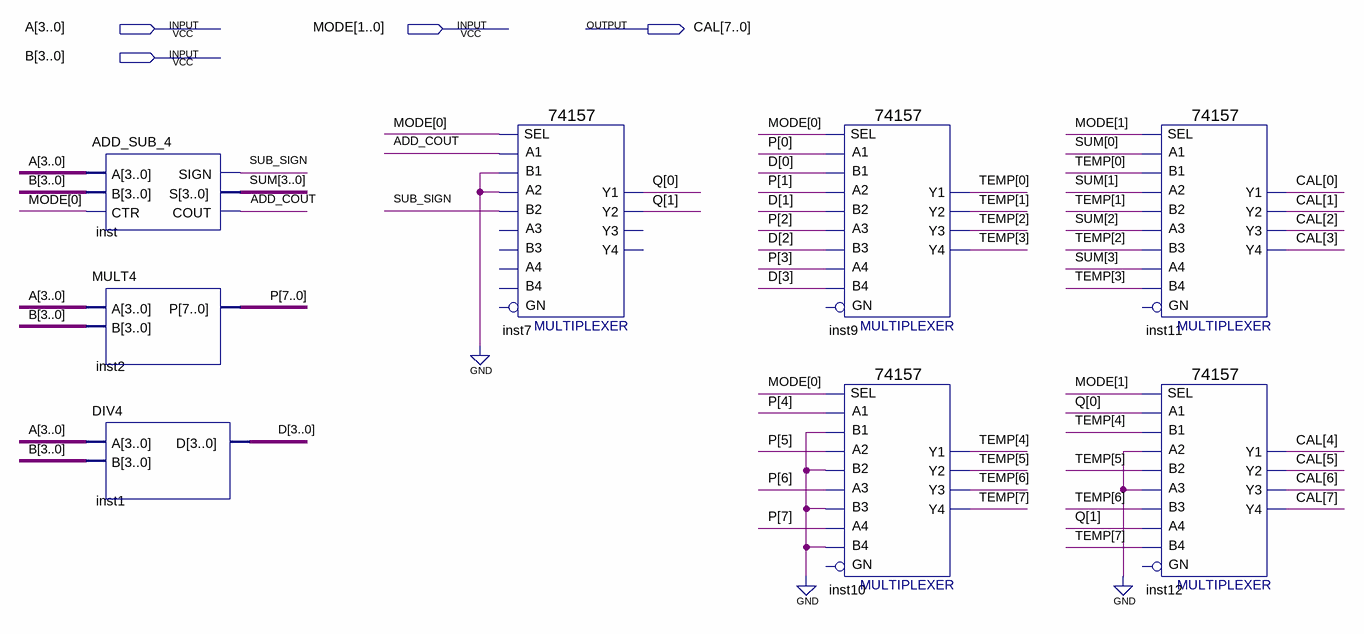
[diagram p0: schematic sheet]
// Quartus schematic CALC.bdf as structural Verilog: 8 symbols, 4 pins
module CALC (
  input  [3:0] A,
  input  [1:0] MODE,
  input  [3:0] B,
  output [7:0] CAL
);

  wire ADD_COUT, SUB_SIGN;
  wire [1:0] Q;
  wire [3:0] D, SUM;
  wire [7:0] P, TEMP;

  ADD_SUB_4 inst (.A(A), .B(B), .CTR(MODE[0]), .SIGN(SUB_SIGN), .S(SUM), .COUT(ADD_COUT));
  MULT4 inst2 (.A(A), .B(B), .P(P));
  DIV4 inst1 (.A(A), .B(B), .D(D));
  \74157  inst7 (
    .A1(ADD_COUT), .B1(1'b0), .SEL(MODE[0]), .B2(SUB_SIGN), .A2(1'b0), .Y2(Q[1]), .Y1(Q[0]));  // open: A3, B3, B4, GN, A4, Y4, Y3
  \74157  inst9 (
    .A1(P[0]), .B1(D[0]), .SEL(MODE[0]), .B2(D[1]), .A3(P[2]), .B3(D[2]), .A2(P[1]), .B4(D[3]), .A4(P[3]),
    .Y2(TEMP[1]), .Y1(TEMP[0]), .Y4(TEMP[3]), .Y3(TEMP[2]));  // open: GN
  \74157  inst10 (
    .A1(P[4]), .B1(1'b0), .SEL(MODE[0]), .B2(1'b0), .A3(P[6]), .B3(1'b0), .A2(P[5]), .B4(1'b0), .A4(P[7]),
    .Y2(TEMP[5]), .Y1(TEMP[4]), .Y4(TEMP[7]), .Y3(TEMP[6]));  // open: GN
  \74157  inst11 (
    .A1(SUM[0]), .B1(TEMP[0]), .SEL(MODE[1]), .B2(TEMP[1]), .A3(SUM[2]), .B3(TEMP[2]), .A2(SUM[1]),
    .B4(TEMP[3]), .A4(SUM[3]), .Y2(CAL[1]), .Y1(CAL[0]), .Y4(CAL[3]), .Y3(CAL[2]));  // open: GN
  \74157  inst12 (
    .A1(Q[0]), .B1(TEMP[4]), .SEL(MODE[1]), .B2(TEMP[5]), .A3(1'b0), .B3(TEMP[6]), .A2(1'b0), .B4(TEMP[7]),
    .A4(Q[1]), .Y2(CAL[5]), .Y1(CAL[4]), .Y4(CAL[7]), .Y3(CAL[6]));  // open: GN
endmodule
